# EAGLE design Blueshift V1 (EAGLE 9.5.1)
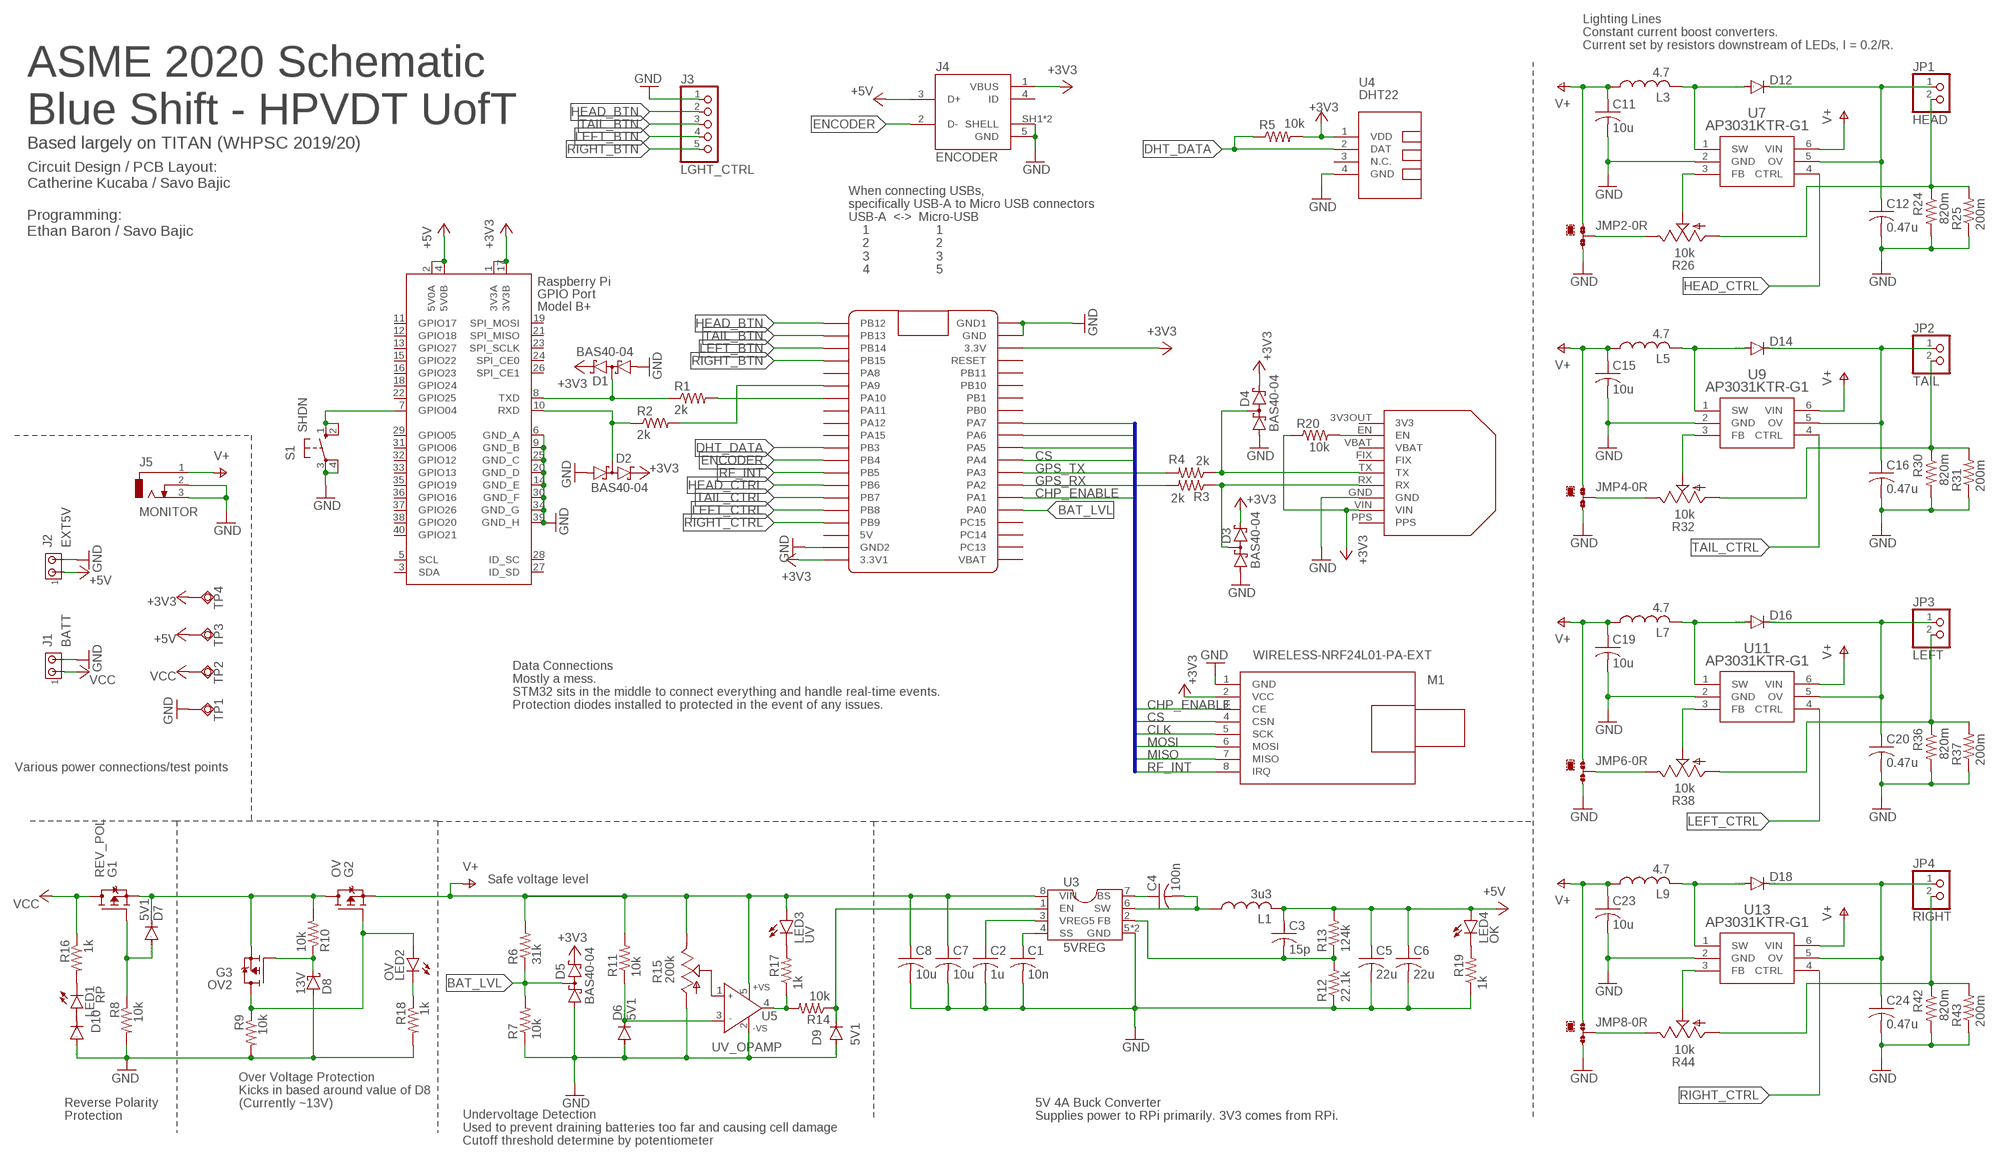
[diagram p0: schematic, sheet 1]

## Parts
C1  10n  C-USC0402  [C0402]
C2  1u  C-USC0402  [C0402]
C3  15p  C-USC0402  [C0402]
C4  100n  C-USC0402  [C0402]
C5  22u  C-USC0805  [C0805]
C6  22u  C-USC0805  [C0805]
C7  10u  C-USC0805  [C0805]
C8  10u  C-USC0805  [C0805]
C11  10u  C-USC1206K  [C1206K]
C12  0.47u  C-USC1206K  [C1206K]
C15  10u  C-USC1206K  [C1206K]
C16  0.47u  C-USC1206K  [C1206K]
C19  10u  C-USC1206K  [C1206K]
C20  0.47u  C-USC1206K  [C1206K]
C23  10u  C-USC1206K  [C1206K]
C24  0.47u  C-USC1206K  [C1206K]
D1  BAS40-04  [SOT23]
D2  BAS40-04  [SOT23]
D3  BAS40-04  [SOT23]
D4  BAS40-04  [SOT23]
D5  BAS40-04  [SOT23]
D6  5V1  DIODE-SOD323-R  [SOD323-R]
D7  5V1  DIODE-SOD323-R  [SOD323-R]
D8  13V  BAS70  [SOT23]
D9  5V1  DIODE-SOD323-R  [SOD323-R]
D10  DIODE-SOD80C  [SOD80C]
D12  DIODE-DO-214AC  [DO-214AC]
D14  DIODE-DO-214AC  [DO-214AC]
D16  DIODE-DO-214AC  [DO-214AC]
D18  DIODE-DO-214AC  [DO-214AC]
G1  REV_POL  SI3493DDV-T1-GE3  [TSOP-6]
G2  OV  SI3493DDV-T1-GE3  [TSOP-6]
G3  OV2  SI3493DDV-T1-GE3  [TSOP-6]
J1  BATT  MTA02-156  [1X2MTA]
J2  EXT5V  MTA02-156  [1X2MTA]
J3  LGHT_CTRL  PINHD-1X5  [1X05]
J4  ENCODER  2172034-1  [TE_2172034-1]
J5  MONITOR  DCJ0303  [DCJ0303]
JMP2  0R-JUMPA  [A0R-JMP]
JMP4  0R-JUMPA  [A0R-JMP]
JMP6  0R-JUMPA  [A0R-JMP]
JMP8  0R-JUMPA  [A0R-JMP]
JP1  HEAD  PINHD-1X2  [1X02]
JP2  TAIL  PINHD-1X2  [1X02]
JP3  LEFT  PINHD-1X2  [1X02]
JP4  RIGHT  PINHD-1X2  [1X02]
L1  3u3  SDES064T-3R3MS  [SDES064T]
L3  4.7  NR6028NR6028  [INDDFN600X600X280-2N]
L5  4.7  NR6028NR6028  [INDDFN600X600X280-2N]
L7  4.7  NR6028NR6028  [INDDFN600X600X280-2N]
L9  4.7  NR6028NR6028  [INDDFN600X600X280-2N]
LED1  RP  LEDSML0805  [SML0805]
LED2  OV  LEDSML0805  [SML0805]
LED3  UV  LEDSML0805  [SML0805]
LED4  OK  LEDSML0805  [SML0805]
M1  WIRELESS-NRF24L01-PA-EXT  [WIRELESS-NRF24L01-PA-EXT]
M2  ULTIMATE-GPS  [ULTIMATE_GPS]
R1  2k  R-US_R0402  [R0402]
R2  2k  R-US_R0402  [R0402]
R3  2k  R-US_R0402  [R0402]
R4  2k  R-US_R0402  [R0402]
R5  10k  R-US_R0402  [R0402]
R6  31k  R-US_R0402  [R0402]
R7  10k  R-US_R0402  [R0402]
R8  10k  R-US_R0402  [R0402]
R9  10k  R-US_R0402  [R0402]
R10  10k  R-US_R0402  [R0402]
R11  10k  R-US_R0402  [R0402]
R12  22.1k  R-US_R0402  [R0402]
R13  124k  R-US_R0402  [R0402]
R14  10k  R-US_R0402  [R0402]
R15  200k  TRIM_US-CA6V  [CA6V]
R16  1k  R-US_R0402  [R0402]
R17  1k  R-US_R0402  [R0402]
R18  1k  R-US_R0402  [R0402]
R19  1k  R-US_R0402  [R0402]
R20  10k  R-US_R0402  [R0402]
R24  820m  R-US_R0603  [R0603]
R25  200m  R-US_R0805  [R0805]
R26  10k  TRIM_US-RJ9W  [RJ9W]
R30  820m  R-US_R0603  [R0603]
R31  200m  R-US_R0805  [R0805]
R32  10k  TRIM_US-RJ9W  [RJ9W]
R36  820m  R-US_R0603  [R0603]
R37  200m  R-US_R0805  [R0805]
R38  10k  TRIM_US-RJ9W  [RJ9W]
R42  820m  R-US_R0603  [R0603]
R43  200m  R-US_R0805  [R0805]
R44  10k  TRIM_US-RJ9W  [RJ9W]
S1  SHDN  10-XX  [B3F-10XX]
TP1  TPSQTP20SQ  [TP20SQ]
TP2  TPSQTP20R  [TP20R]
TP3  TPSQTP20R  [TP20R]
TP4  TPSQTP20R  [TP20R]
U1  RASPI_HAT  [RASPI_BOARD_B+HAT_CF]
U2  BLUEPILL  BLUE_PILL  [BLUE_PILL]
U3  5VREG  AP65450SP-13  [SO-8EP]
U4  DHT22  TEMP-HUM-SENSOR-DHT22  [TEMP-HUM-SENSOR-DHT22]
U5  UV_OPAMP  TA75S558F,LF  [SOT-753]
U7  AP3031KTR-G1  [SOT23-6]
U9  AP3031KTR-G1  [SOT23-6]
U11  AP3031KTR-G1  [SOT23-6]
U13  AP3031KTR-G1  [SOT23-6]

## Nets
5V_FB: C3.2 R12.2 R13.1 U3.2(FB)
+3V3: D1.2(C2) D2.2(C2) D3.2(C2) D4.2(C2) D5.2(C2) J4.1(VBUS) M1.2(VCC) M2.VIN R5.2 R20.1 TP4.TP U1.1(3V3A) U1.17(3V3B) U2.P$20(3.3V1) U2.P$23(3.3V) U4.1(VDD)
+5V: C3.1 C5.1 C6.1 J2.1 J4.3(D+) L1.2 LED4.A R13.2 TP3.TP U1.2(5V0A) U1.4(5V0B)
BAT_LVL: D5.3(C1A2) R6.1 R7.2 U2.P$36(PA0)
CHP_ENABLE: M1.3(CE) U2.P$35(PA1)
CLK: M1.5(SCK) U2.P$31(PA5)
CS: M1.4(CSN) U2.P$32(PA4)
DHT_DATA: R5.1 U2.P$11(PB3) U4.2(DAT)
ENCODER: J4.2(D-) U2.P$12(PB4)
GND: C1.2 C2.2 C5.2 C6.2 C7.2 C8.2 C11.2 C12.2 C15.2 C16.2 C19.2 C20.2 C23.2 C24.2 D1.1(A1) D2.1(A1) D3.1(A1) D4.1(A1) D5.1(A1) D6.A D8.1(A) D9.A D10.A J1.2 J2.2 J3.1 J4.5(GND) J4.SH1(SHELL) J4.SH2(SHELL) J5.2 J5.3 JMP2.3 JMP4.3 JMP6.3 JMP8.3 M1.1(GND) M2.GND R7.1 R8.2 R9.2 R12.1 R15.A R18.2 R19.1 R24.2 R25.1 R30.2 R31.1 R36.2 R37.1 R42.2 R43.1 S1.3(P) S1.4(P1) TP1.TP U1.6(GND_A) U1.9(GND_B) U1.14(GND_E) U1.20(GND_D) U1.25(GND_C) U1.30(GND_F) U1.34(GND_G) U1.39(GND_H) U2.P$19(GND2) U2.P$21(GND1) U2.P$22(GND) U3.5(GND) U3.TP(GND) U4.4(GND) U5.2(-VS) U7.2(GND) U9.2(GND) U11.2(GND) U13.2(GND)
GPS_RX: R3.2 U2.P$34(PA2)
GPS_TX: R4.2 U2.P$33(PA3)
HEAD_BTN: J3.2 U2.P$1(PB12)
HEAD_CTRL: U2.P$14(PB6) U7.4(CTRL)
LEFT_BTN: J3.4 U2.P$3(PB14)
LEFT_CTRL: U2.P$16(PB8) U11.4(CTRL)
MISO: M1.7(MISO) U2.P$30(PA6)
MOSI: M1.6(MOSI) U2.P$29(PA7)
N$1: R1.2 U2.P$7(PA10)
N$2: R2.2 U2.P$6(PA9)
N$3: D1.3(C1A2) R1.1 U1.8(TXD)
N$4: D2.3(C1A2) R2.1 U1.10(RXD)
N$5: D3.3(C1A2) M2.RX R3.1
N$6: S1.1(S) S1.2(S1) U1.7(GPIO04)
N$7: D8.3(C) G3.3(G) R10.1
N$8: D7.A G1.3(G) R8.1
N$9: D4.3(C1A2) M2.TX R4.1
N$10: G2.3(G) G3.1(D) G3.2(D) G3.5(D) G3.6(D) LED2.A R9.1
N$11: LED3.C R17.2
N$12: C1.1 U3.4(SS)
N$13: D6.C R11.1 U5.3(IN-)
N$14: C4.2 L1.1 U3.6(SW)
N$15: C2.1 U3.3(VREG5)
N$16: C4.1 U3.7(BS)
N$17: R14.2 R17.1 U5.4(OUT)
N$18: D9.C R14.1 U3.1(EN)
N$19: R15.S U5.1(IN+)
N$20: LED1.C R16.2
N$21: D10.C LED1.A
N$22: M2.EN R20.2
N$23: LED2.C R18.1
N$24: LED4.C R19.2
N$25: D7.C G1.4(S) G2.1(D) G2.2(D) G2.5(D) G2.6(D) G3.4(S) R10.2
N$31: D12.A L3.2 U7.1(SW)
N$32: JMP2.2 R26.E
N$33: R26.S U7.3(FB)
N$34: C12.1 D12.C JP1.1 U7.5(OV)
N$35: JP1.2 R24.1 R25.2 R26.A
N$41: D14.A L5.2 U9.1(SW)
N$42: JMP4.2 R32.E
N$43: R32.S U9.3(FB)
N$44: C16.1 D14.C JP2.1 U9.5(OV)
N$45: JP2.2 R30.1 R31.2 R32.A
N$51: D16.A L7.2 U11.1(SW)
N$52: JMP6.2 R38.E
N$53: R38.S U11.3(FB)
N$54: C20.1 D16.C JP3.1 U11.5(OV)
N$55: JP3.2 R36.1 R37.2 R38.A
N$61: D18.A L9.2 U13.1(SW)
N$62: JMP8.2 R44.E
N$63: R44.S U13.3(FB)
N$64: C24.1 D18.C JP4.1 U13.5(OV)
N$65: JP4.2 R42.1 R43.2 R44.A
RF_INT: M1.8(IRQ) U2.P$13(PB5)
RIGHT_BTN: J3.5 U2.P$4(PB15)
RIGHT_CTRL: U2.P$17(PB9) U13.4(CTRL)
TAIL_BTN: J3.3 U2.P$2(PB13)
TAIL_CTRL: U2.P$15(PB7) U9.4(CTRL)
V+: C7.1 C8.1 C11.1 C15.1 C19.1 C23.1 G2.4(S) J5.1 JMP2.1 JMP4.1 JMP6.1 JMP8.1 L3.1 L5.1 L7.1 L9.1 LED3.A R6.2 R11.2 R15.E U3.8(VIN) U5.5(+VS) U7.6(VIN) U9.6(VIN) U11.6(VIN) U13.6(VIN)
VCC: G1.1(D) G1.2(D) G1.5(D) G1.6(D) J1.1 R16.1 TP2.TP
Unconnected: J4.4(ID) M2.3V3OUT(3V3) M2.FIX M2.PPS M2.VBAT U1.3(SDA) U1.5(SCL) U1.11(GPIO17) U1.12(GPIO18) U1.13(GPIO27) U1.15(GPIO22) U1.16(GPIO23) U1.18(GPIO24) U1.19(SPI_MOSI) U1.21(SPI_MISO) U1.22(GPIO25) U1.23(SPI_SCLK) U1.24(SPI_CE0) U1.26(SPI_CE1) U1.27(ID_SD) U1.28(ID_SC) U1.29(GPIO05) U1.31(GPIO06) U1.32(GPIO12) U1.33(GPIO13) U1.35(GPIO19) U1.36(GPIO16) U1.37(GPIO26) U1.38(GPIO20) U1.40(GPIO21) U2.P$5(PA8) U2.P$8(PA11) U2.P$9(PA12) U2.P$10(PA15) U2.P$18(5V) U2.P$24(RESET) U2.P$25(PB11) U2.P$26(PB10) U2.P$27(PB1) U2.P$28(PB0) U2.P$37(PC15) U2.P$38(PC14) U2.P$39(PC13) U2.P$40(VBAT) U4.3(N.C.)

## Buses
SPI:CHP_ENABLE,CLK,CS,MISO,MOSI,RF_INT

## Notes on the sheet
- Lighting Lines
  Constant current boost converters. 
  Current set by resistors downstream of LEDs, I = 0.2/R.
- ASME 2020 Schematic
  Blue Shift - HPVDT UofT
- Based largely on TITAN (WHPSC 2019/20)
- Circuit Design / PCB Layout:
  Catherine Kucaba / Savo Bajic
  
  Programming:
  Ethan Baron / Savo Bajic
- When connecting USBs, 
  specifically USB-A to Micro USB connectors
  USB-A  <->  Micro-USB
      1                   1
      2                   2
      3                   3
      4                   5
- Data Connections
  Mostly a mess.
  STM32 sits in the middle to connect everything and handle real-time events.
  Protection diodes installed to protected in the event of any issues.
- Various power connections/test points
- Safe voltage level
- Over Voltage Protection
  Kicks in based around value of D8
  (Currently ~13V)
- Reverse Polarity
  Protection
- 5V 4A Buck Converter
  Supplies power to RPi primarily. 3V3 comes from RPi.
- Undervoltage Detection
  Used to prevent draining batteries too far and causing cell damage
  Cutoff threshold determine by potentiometer

## Library data of the parts
C1-C8 C11 C12 C15 C16 C19 C20 C23 C24 = rcl:C-US: CAPACITOR, American symbol; SPICEPREFIX: C
D1-D5 = diode:BAS40-04: Silicon Schottky Diodes General-purpose diode for high-speed switching
D6 D7 D9 D10 D12 D14 D16 D18 = diode:DIODE-: DIODE
D8 = diode:BAS70: Silicon Schottky Diodes General-purpose diode for high-speed switching
G1-G3 = ASME2020_parts:SI3493DDV-T1-GE3: 20V P-CH MOSFET
J1 J2 = con-amp:MTA02-156: AMP connector
J3 = pinhead:PINHD-1X5: PIN HEADER
J4 = 2172034-1:2172034-1: CONN RCPT USB MINI B 2.0 PCB R/A; COMMENT: 2172034-1; DESCRIPTION: Conn Mini USB Type B RCP 5 POS 0.8mm Solder RA Thru-Hole 5 Terminal 1 Port Box/Tray; DIGI-KEY_PART_NUMBER: A135698-ND; DIGI-KEY_PURCHASE_URL: https://www.digikey.com/product-detail/en/te-connectivity-amp-connectors/2172034-1/A135698-ND/5592056?utm_source=snapeda&utm_medium=aggregator&utm_campaign=symbol; EU_ROHS_COMPLIANCE: Compliant; MF: TE Connectivity; MP: 2172034-1; PACKAGE: None; TE_PURCHASE_URL: https://www.te.com/usa-en/product-2172034-1.html?te_bu=Cor&te_type=disp&te_campaign=seda_glo_cor-seda-global-disp-prtnr-fy19-seda-model-bom-cta_sma-317_1&elqCampaignId=32493
J5 = con-jack:DCJ0303: DC POWER JACK Source: DCJ0303.pdf; OC_FARNELL: unknown; OC_NEWARK: unknown
JMP2 JMP4 JMP6 JMP8 = jump-0r-smd:0R-JUMP: SMD 0R 0805 Jumper
JP1-JP4 = pinhead:PINHD-1X2: PIN HEADER
L1 = ASME2020_parts:SDES064T-3R3MS
L3 L5 L7 L9 = Lighting IC:NR6028
LED1-LED4 = led:LED: LED OSRAM: - CHIPLED LG R971, LG N971, LY N971, LG Q971, LY Q971, LO R971, LY R971 LH N974, LH R974 LS Q976, LO Q976, LY Q976 LO Q996 - Hyper CHIPLED LW Q18S LB Q993, LB Q99A, LB R99A - SideLED LS A670, LO A670, LY A670, LG A670, LP A670 LB A673, LV A673, LT A673, LW A673 LH A674 LY A675 LS A676, LA A676, LO A676, LY A676, LW A676 LS A679, LY A679, LG A679 - Hyper Micro SIDELED® LS Y876, LA Y876, LO Y876, LY Y876 LT Y87S - SmartLED LW L88C, LW L88S LB L89C, LB L89S, LG L890 LS L89K, LO L89K, LY L89K LS L896, LA L896, LO L896, LY L896 - TOPLED LS T670, LO T670, LY T670, LG T670, LP T670 LSG T670, LSP T670, LSY T670, LOP T670, LYG T670 LG T671, LOG T671, LSG T671 LB T673, LV T673, LT T673, LW T673 LH T674 LS T676, LA T676, LO T676, LY T676, LB T676, LH T676, LSB T676, LW T676 LB T67C, LV T67C, LT T67C, LS T67K, LO T67K, LY T67K, LW E67C LS E67B, LA E67B, LO E67B, LY E67B, LB E67C, LV E67C, LT E67C LW T67C LS T679, LY T679, LG T679 LS T770, LO T770, LY T770, LG T770, LP T770 LB T773, LV T773, LT T773, LW T773 LH T774 LS E675, LA E675, LY E675, LS T675 LS T776, LA T776, LO T776, LY T776, LB T776 LHGB T686 LT T68C, LB T68C - Hyper Mini TOPLED® LB M676 - Mini TOPLED Santana® LG M470 LS M47K, LO M47K, LY M47K Source: http://www.osram.convergy.de LUXEON: - LUMILED® LXK2-PW12-R00, LXK2-PW12-S00, LXK2-PW14-U00, LXK2-PW14-V00 LXK2-PM12-R00, LXK2-PM12-S00, LXK2-PM14-U00 LXK2-PE12-Q00, LXK2-PE12-R00, LXK2-PE12-S00, LXK2-PE14-T00, LXK2-PE14-U00 LXK2-PB12-K00, LXK2-PB12-L00, LXK2-PB12-M00, LXK2-PB14-N00, LXK2-PB14-P00, LXK2-PB14-Q00 LXK2-PR12-L00, LXK2-PR12-M00, LXK2-PR14-Q00, LXK2-PR14-R00 LXK2-PD12-Q00, LXK2-PD12-R00, LXK2-PD12-S00 LXK2-PH12-R00, LXK2-PH12-S00 LXK2-PL12-P00, LXK2-PL12-Q00, LXK2-PL12-R00 Source: www.luxeon.com KINGBRIGHT: KA-3528ASYC Source: www.kingbright.com
M1 = diy-modules:WIRELESS-NRF24L01-PA-EXT: 2.4 GHz Wireless Module based on NRF24L01 chip with preamplifier and external antenna Click here to find device on ebay.com <http://www.ebay.com/sch/nrf24l01+pa+lna+sma>
M2 = diy-modules:ULTIMATE-GPS
R1-R14 R16-R20 R24 R25 R30 R31 R36 R37 R42 R43 = rcl:R-US_: RESISTOR, American symbol; SPICEPREFIX: R
R15 R26 R32 R38 R44 = pot:TRIM_US-: POTENTIOMETER
S1 = switch-omron:10-XX: OMRON SWITCH; MPN: B3F-1000; OC_FARNELL: 176432; OC_NEWARK: 36M3542
TP1-TP4 = testpad:TPSQ: Test pad
U1 = raspberrypi_bastelstube_v13:RASPI_HAT
U2 = BluePill:BLUE_PILL
U3 = ASME2020_parts:AP65450SP-13: AP65450 4A, 18V, 650kHz ADAPTIVE COT STEP-DOWN CONVERTER
U4 = diy-modules:TEMP-HUM-SENSOR-DHT22: DHT22 - digital humidity & temperature sensor Also known as: AM2302 AM2302 datasheet available here: http://akizukidenshi.com/download/ds/aosong/AM2302.pdf Click here to find device on ebay.com <http://www.ebay.com/sch/dht22+digital+sensor>
U5 = ASME2020_parts:TA75S558F,LF
U7 U9 U11 U13 = Lighting IC:AP3031KTR-G1: AP3031 step-up LED driver chip for LEDs up to 1.4A; MANUFACTURER_PART_NUMBER: AP3031KTRG1; VENDOR: Diodes Inc

## Board
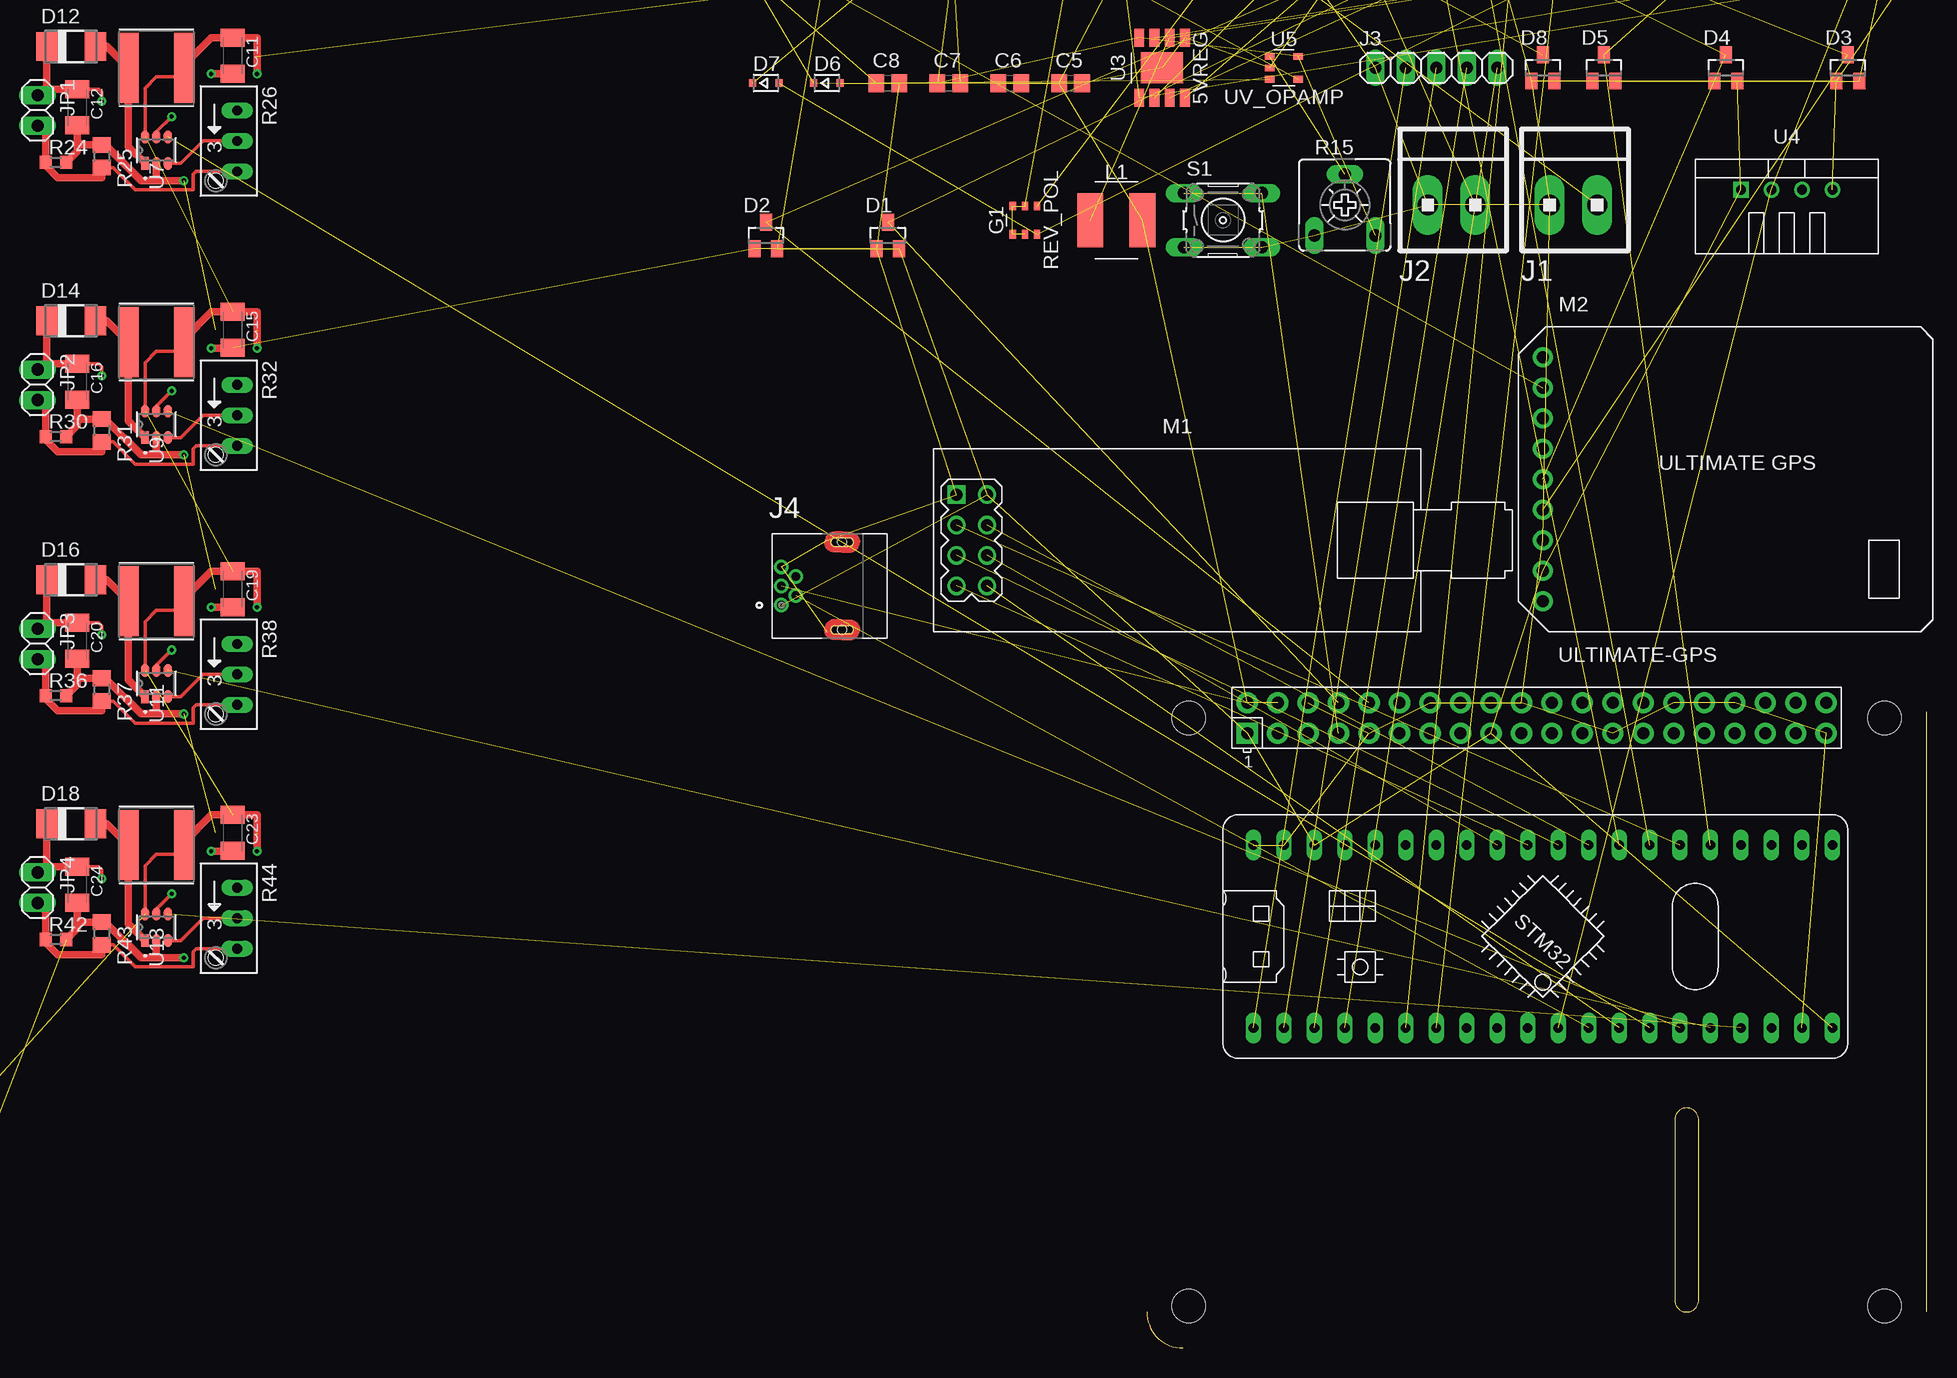
[diagram p1: board, top side]
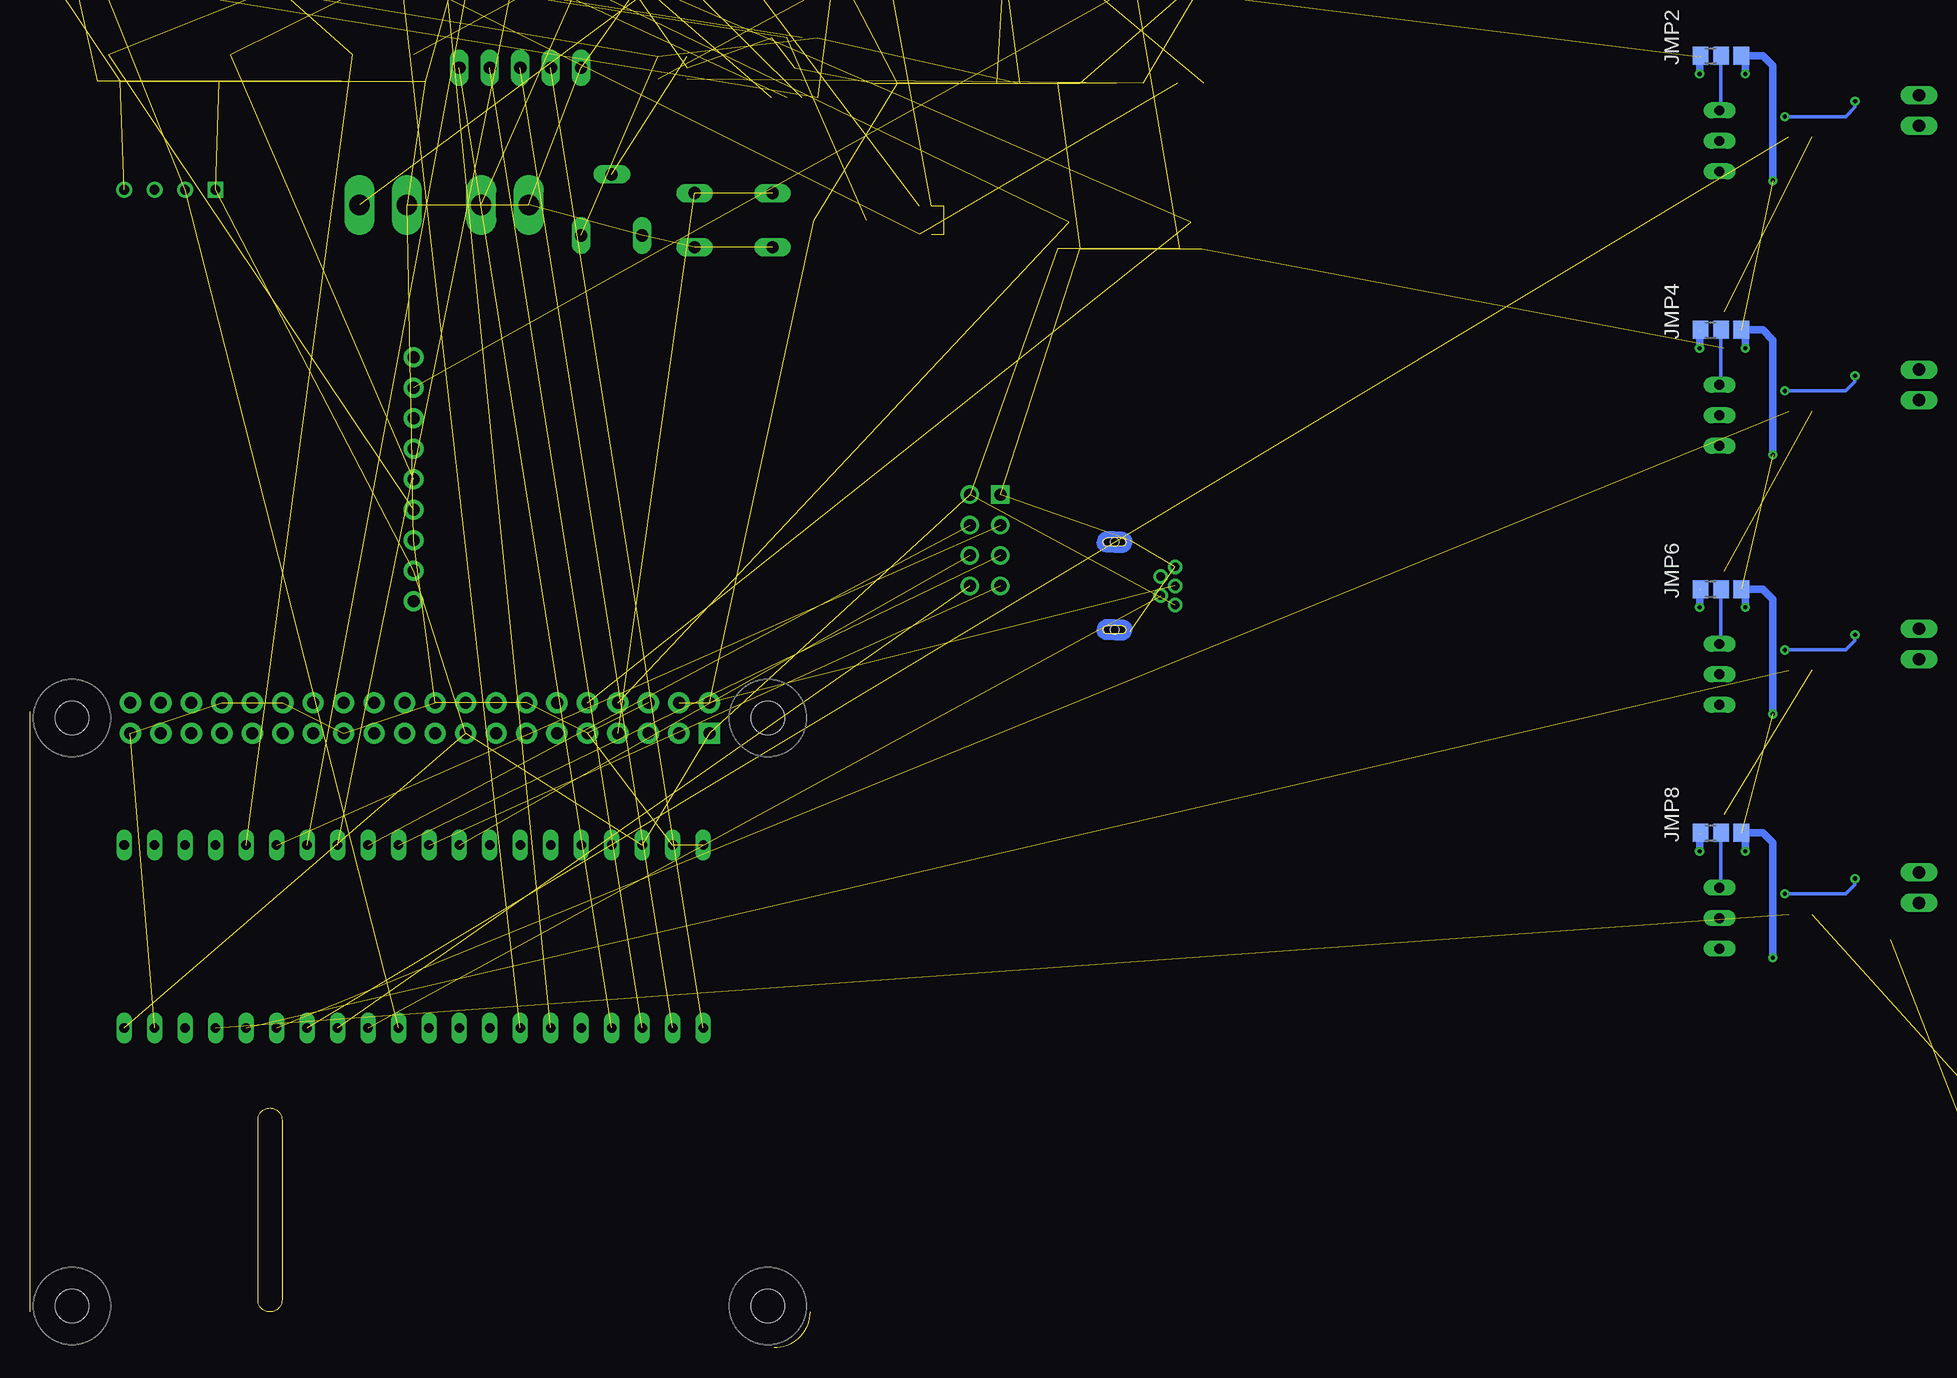
[diagram p2: board, bottom side, seen from below]

Size 65 x 53 mm. Coordinates in mm from the lower left corner, seen from the top.
Copper layers (1*16): Top 0.035mm / dielectric 1.5mm / Bottom 0.035mm
Design rules "default": minimum track width 6mil, minimum drill 0.35mm, track to track 6mil, track to pad 6mil, pad to pad 6mil, via to via 6mil, smd to smd 6mil, copper to edge 40mil, drill to drill 6mil, minimum pad ring 10mil, minimum via ring 8mil, stop-mask expansion 4mil, vias tented up to drill 0mil, thermal gap 10mil

### Footprints (pad centres in the part's own frame; a part is rotated, then mirrored left to right if it is on the bottom)
C0402 = smd 0.7 x 0.9: 1 -0.65,0; 2 0.65,0
C0805 = smd 1.3 x 1.5: 1 -0.95,0; 2 0.95,0
C1206K = smd 1.5 x 2: 1 -1.5,0; 2 1.5,0
SOT23 = smd 1 x 1.4: 1 -0.95,-1.1; 2 0.95,-1.1; 3 0,1.1
SOD323-R = smd 0.6 x 0.6: A 1.1,0; C -1.1,0
SOD80C = smd 1.4 x 1.8: A 1.7,0; C -1.7,0
DO-214AC = smd 1.8 x 2.4: A 2.025,0; C -2.025,0
TSOP-6 = smd 0.508 x 0.711: 1 -1.016,-1.168; 2 0,-1.168; 3 1.016,-1.168; 4 1.016,1.168; 5 0,1.168; 6 -1.016,1.168
1X2MTA = drill 1.676 long: 1 1.981,0; 2 -1.981,0
1X05 = drill 1.016 long: 1 -5.08,0; 2 -2.54,0; 3 0,0; 4 2.54,0; 5 5.08,0
TE_2172034-1 = drill 0.7: 1 -5.05,-1.6; 2 -3.85,-0.8; 3 -5.05,0; 4 -3.85,0.8; 5 -5.05,1.6 | smd 0.1 x 0.1: SH1 -1.27,3.81; SH2 -1.27,-3.81 | hole 0.7: 0,3.65; 0,-3.65
DCJ0303 = drill 1 pad 2 long: 1 0,3.1; 2 4.8,0; 3 0,-3
A0R-JMP = smd 1.5 x 1.3: 1 0,1.7; 2 0,0; 3 0,-1.7
1X02 = drill 1.016 long: 1 -1.27,0; 2 1.27,0
SDES064T = smd 2.15 x 4.5: 1 -2.175,0; 2 2.175,0
INDDFN600X600X280-2N = smd 1.712 x 5.812: 1 -2.35,0; 2 2.35,0
SML0805 = smd 1.2 x 1.2: A 1.05,0; C -1.05,0
WIRELESS-NRF24L01-PA-EXT = drill 1 square: 1 -18.415,3.81 | drill 1: 2 -15.875,3.81; 3 -18.415,1.27; 4 -15.875,1.27; 5 -18.415,-1.27; 6 -15.875,-1.27; 7 -18.415,-3.81; 8 -15.875,-3.81
ULTIMATE_GPS = drill 1 pad 1.676: 3V3OUT 0,10.16; EN 0,7.62; FIX 0,2.54; GND 0,-5.08; PPS 0,-10.16; RX 0,-2.54; TX 0,0; VBAT 0,5.08; VIN 0,-7.62
R0402 = smd 0.6 x 0.7: 1 -0.5,0; 2 0.5,0
CA6V = drill 1.016 long: A -2.54,-2.54; E 2.54,-2.54; S 0,2.54
R0603 = smd 1 x 1.1: 1 -0.85,0; 2 0.85,0
R0805 = smd 1.3 x 1.5: 1 -0.95,0; 2 0.95,0
RJ9W = drill 0.813 long: A 2.54,0.635; E -2.54,0.635; S 0,0.635
B3F-10XX = drill 1.016 long: 1 -3.251,2.261; 2 3.251,2.261; 3 -3.251,-2.261; 4 3.251,-2.261
TP20SQ = smd 2 x 2: TP 0,0
TP20R = smd 2 x 2: TP 0,0
RASPI_BOARD_B+HAT_CF = drill 1 pad 1.778 square: 1 8.37,51.23 | drill 1 pad 1.778: 2 8.37,53.77; 3 10.91,51.23; 4 10.91,53.77; 5 13.45,51.23; 6 13.45,53.77; 7 15.99,51.23; 8 15.99,53.77; 9 18.53,51.23; 10 18.53,53.77; 11 21.07,51.23; 12 21.07,53.77; 13 23.61,51.23; 14 23.61,53.77; 15 26.15,51.23; 16 26.15,53.77; 17 28.69,51.23; 18 28.69,53.77; 19 31.23,51.23; 20 31.23,53.77; 21 33.77,51.23; 22 33.77,53.77; 23 36.31,51.23; 24 36.31,53.77; 25 38.85,51.23; 26 38.85,53.77; 27 41.39,51.23; 28 41.39,53.77; 29 43.93,51.23; 30 43.93,53.77; 31 46.47,51.23; 32 46.47,53.77; 33 49.01,51.23; 34 49.01,53.77; 35 51.55,51.23; 36 51.55,53.77; 37 54.09,51.23; 38 54.09,53.77; 39 56.63,51.23; 40 56.63,53.77 | hole 2.75: 3.5,3.5; 3.5,52.5; 61.5,3.5; 61.5,52.5
BLUE_PILL = drill 0.8 long: P$1 -7.62,15.24; P$2 -7.62,12.7; P$3 -7.62,10.16; P$4 -7.62,7.62; P$5 -7.62,5.08; P$6 -7.62,2.54; P$7 -7.62,0; P$8 -7.62,-2.54; P$9 -7.62,-5.08; P$10 -7.62,-7.62; P$11 -7.62,-10.16; P$12 -7.62,-12.7; P$13 -7.62,-15.24; P$14 -7.62,-17.78; P$15 -7.62,-20.32; P$16 -7.62,-22.86; P$17 -7.62,-25.4; P$18 -7.62,-27.94; P$19 -7.62,-30.48; P$20 -7.62,-33.02; P$21 7.62,15.24; P$22 7.62,12.7; P$23 7.62,10.16; P$24 7.62,7.62; P$25 7.62,5.08; P$26 7.62,2.54; P$27 7.62,0; P$28 7.62,-2.54; P$29 7.62,-5.08; P$30 7.62,-7.62; P$31 7.62,-10.16; P$32 7.62,-12.7; P$33 7.62,-15.24; P$34 7.62,-17.78; P$35 7.62,-20.32; P$36 7.62,-22.86; P$37 7.62,-25.4; P$38 7.62,-27.94; P$39 7.62,-30.48; P$40 7.62,-33.02
SO-8EP = smd 0.802 x 1.505: 1 -1.905,-2.498; 2 -0.635,-2.498; 3 0.635,-2.498; 4 1.905,-2.498; 5 1.905,2.498; 6 0.635,2.498; 7 -0.635,2.498; 8 -1.905,2.498 | smd 3.502 x 2.613: TP 0,0
TEMP-HUM-SENSOR-DHT22 = drill 0.8 square: 1 -3.81,0 | drill 0.8: 2 -1.27,0; 3 1.27,0; 4 3.81,0
SOT-753 = smd 0.8 x 0.55: 1 -1.2,0.95; 2 -1.2,0; 3 -1.2,-0.95; 4 1.2,-0.95; 5 1.2,0.95
SOT23-6 = smd 1.06 x 0.65: 1 -1.1,0.95; 2 -1.1,0; 3 -1.1,-0.95; 4 1.1,-0.95; 5 1.1,0; 6 1.1,0.95

### Placement (x,y rotation side)
C1  13.97,113.03 0 top  (outside the outline)
C2  38.1,120.65 0 top  (outside the outline)
C3  8.89,113.03 0 top  (outside the outline)
C4  25.4,113.03 0 top  (outside the outline)
C5  -6.35,105.41 0 top  (outside the outline)
C6  -11.43,105.41 0 top  (outside the outline)
C7  -16.51,105.41 0 top  (outside the outline)
C8  -21.59,105.41 0 top  (outside the outline)
C11  -76.2,107.7 270 top  (outside the outline)
C12  -89.15,103.38 270 top  (outside the outline)
C15  -76.2,84.84 270 top  (outside the outline)
C16  -89.15,80.52 270 top  (outside the outline)
C19  -76.2,63.25 270 top  (outside the outline)
C20  -89.15,58.93 270 top  (outside the outline)
C23  -76.2,42.93 270 top  (outside the outline)
C24  -89.15,38.61 270 top  (outside the outline)
D1  -21.59,92.71 0 top  (outside the outline)
D2  -31.75,92.71 0 top  (outside the outline)
D3  58.42,106.68 0 top  (outside the outline)
D4  48.26,106.68 0 top  (outside the outline)
D5  38.1,106.68 0 top  (outside the outline)
D6  -26.67,105.41 0 top  (outside the outline)
D7  -31.75,105.41 0 top  (outside the outline)
D8  33.02,106.68 0 top  (outside the outline)
D9  62.23,114.3 0 top  (outside the outline)
D10  -10.16,119.38 0 top  (outside the outline)
D12  -89.66,108.46 0 top  (outside the outline)
D14  -89.66,85.6 0 top  (outside the outline)
D16  -89.66,64.01 0 top  (outside the outline)
D18  -89.66,43.69 0 top  (outside the outline)
G1  -10.16,93.98 0 top  (outside the outline)
G2  -16.51,119.38 0 top  (outside the outline)
G3  12.7,119.38 0 top  (outside the outline)
J1  35.56,95.25 0 top  (outside the outline)
J2  25.4,95.25 0 top  (outside the outline)
J3  24.13,106.68 0 top  (outside the outline)
J4  -25.4,63.5 0 top  (outside the outline)
J5  -104.14,10.16 0 top  (outside the outline)
JMP2  -75.95,107.7 90 bottom  (outside the outline)
JMP4  -75.95,84.84 90 bottom  (outside the outline)
JMP6  -75.95,63.25 90 bottom  (outside the outline)
JMP8  -75.95,42.93 90 bottom  (outside the outline)
JP1  -92.46,103.12 270 top  (outside the outline)
JP2  -92.46,80.26 270 top  (outside the outline)
JP3  -92.46,58.67 270 top  (outside the outline)
JP4  -92.46,38.35 270 top  (outside the outline)
L1  -2.54,93.98 0 top  (outside the outline)
L3  -82.55,106.68 180 top  (outside the outline)
L5  -82.55,83.82 180 top  (outside the outline)
L7  -82.55,62.23 180 top  (outside the outline)
L9  -82.55,41.91 180 top  (outside the outline)
LED1  55.88,113.03 0 top  (outside the outline)
LED2  49.53,113.03 0 top  (outside the outline)
LED3  43.18,113.03 0 top  (outside the outline)
LED4  36.83,113.03 0 top  (outside the outline)
M1  2.54,67.31 0 top  (outside the outline)
M2  33.02,72.39 0 top  (outside the outline)
R1  34.29,120.65 0 top  (outside the outline)
R2  30.48,120.65 0 top  (outside the outline)
R3  26.67,120.65 0 top  (outside the outline)
R4  22.86,120.65 0 top  (outside the outline)
R5  62.23,120.65 0 top  (outside the outline)
R6  57.15,120.65 0 top  (outside the outline)
R7  52.07,120.65 0 top  (outside the outline)
R8  46.99,120.65 0 top  (outside the outline)
R9  41.91,120.65 0 top  (outside the outline)
R10  3.81,113.03 0 top  (outside the outline)
R11  -31.75,113.03 0 top  (outside the outline)
R12  30.48,113.03 0 top  (outside the outline)
R13  19.05,113.03 0 top  (outside the outline)
R14  -1.27,113.03 0 top  (outside the outline)
R15  16.51,95.25 0 top  (outside the outline)
R16  -6.35,113.03 0 top  (outside the outline)
R17  -11.43,113.03 0 top  (outside the outline)
R18  -16.51,113.03 0 top  (outside the outline)
R19  -21.59,113.03 0 top  (outside the outline)
R20  -26.67,113.03 0 top  (outside the outline)
R24  -90.93,98.81 0 top  (outside the outline)
R25  -87.12,99.31 270 top  (outside the outline)
R26  -76.45,100.58 270 top  (outside the outline)
R30  -90.93,75.95 0 top  (outside the outline)
R31  -87.12,76.45 270 top  (outside the outline)
R32  -76.45,77.72 270 top  (outside the outline)
R36  -90.93,54.36 0 top  (outside the outline)
R37  -87.12,54.86 270 top  (outside the outline)
R38  -76.45,56.13 270 top  (outside the outline)
R42  -90.93,34.04 0 top  (outside the outline)
R43  -87.12,34.54 270 top  (outside the outline)
R44  -76.45,35.81 270 top  (outside the outline)
S1  6.35,93.98 0 top  (outside the outline)
TP1  17.78,119.38 0 top  (outside the outline)
TP2  5.08,119.38 0 top  (outside the outline)
TP3  0,119.38 0 top  (outside the outline)
TP4  -5.08,119.38 0 top  (outside the outline)
U1  0,0 0 top
U2  24.13,34.29 90 top
U3  1.27,106.68 0 top  (outside the outline)
U4  53.34,96.52 0 top  (outside the outline)
U5  11.43,106.68 0 top  (outside the outline)
U7  -82.55,99.82 90 top  (outside the outline)
U9  -82.55,76.96 90 top  (outside the outline)
U11  -82.55,55.37 90 top  (outside the outline)
U13  -82.55,35.05 90 top  (outside the outline)

### Tracks (layer width: path | path; a pad name or v marks a point on that pad's centre or on a via)
5V_FB  (3 unrouted)
+3V3  (15 unrouted)
+5V  (10 unrouted)
BAT_LVL  (3 unrouted)
CHP_ENABLE  (1 unrouted)
CLK  (1 unrouted)
CS  (1 unrouted)
DHT_DATA  (2 unrouted)
ENCODER  (1 unrouted)
GND  (via drill 0.35)  (53 unrouted)
  Top 0.635: -82.55,97.28 -83.82,97.28 -86.8,100.26 R25.1 -88.83,100.26 -89.15,100.58 | -82.55,97.28 U7.2 | v-80.26,97.28 -82.55,97.28 | v-77.98,106.17 -76.22,106.17 C11.2 | R24.2 -89.15,99.73 -89.15,100.58 | -89.15,100.58 C12.2 | -82.55,74.42 -83.82,74.42 -86.8,77.4 R31.1 -88.83,77.4 -89.15,77.72 | -82.55,74.42 U9.2 | v-80.26,74.42 -82.55,74.42 | v-77.98,83.31 -76.22,83.31 C15.2 | R30.2 -89.15,76.87 -89.15,77.72 | -89.15,77.72 C16.2 | -82.55,52.83 -83.82,52.83 -86.8,55.81 R37.1 -88.83,55.81 -89.15,56.13 | -82.55,52.83 U11.2 | v-80.26,52.83 -82.55,52.83 | v-77.98,61.72 -76.22,61.72 C19.2 | R36.2 -89.15,55.28 -89.15,56.13 | -89.15,56.13 C20.2 | -82.55,32.51 -83.82,32.51 -86.8,35.49 R43.1 -88.83,35.49 -89.15,35.81 | -82.55,32.51 U13.2 | v-80.26,32.51 -82.55,32.51 | v-77.98,41.4 -76.22,41.4 C23.2 | R42.2 -89.15,34.96 -89.15,35.81 | -89.15,35.81 C24.2
  Bottom 0.635: v-77.98,106.17 -77.98,107.36 JMP2.3 -79.42,107.7 -80.26,106.86 v-80.26,97.28 | v-77.98,83.31 -77.98,84.5 JMP4.3 -79.42,84.84 -80.26,84 v-80.26,74.42 | v-77.98,61.72 -77.98,62.91 JMP6.3 -79.42,63.25 -80.26,62.41 v-80.26,52.83 | v-77.98,41.4 -77.98,42.59 JMP8.3 -79.42,42.93 -80.26,42.09 v-80.26,32.51
GPS_RX  (1 unrouted)
GPS_TX  (1 unrouted)
HEAD_BTN  (1 unrouted)
HEAD_CTRL  (1 unrouted)
LEFT_BTN  (1 unrouted)
LEFT_CTRL  (1 unrouted)
MISO  (1 unrouted)
MOSI  (1 unrouted)
N$1  (1 unrouted)
N$2  (1 unrouted)
N$3  (2 unrouted)
N$4  (2 unrouted)
N$5  (2 unrouted)
N$6  (2 unrouted)
N$7  (2 unrouted)
N$8  (2 unrouted)
N$9  (2 unrouted)
N$10  (6 unrouted)
N$11  (1 unrouted)
N$12  (1 unrouted)
N$13  (2 unrouted)
N$14  (2 unrouted)
N$15  (1 unrouted)
N$16  (1 unrouted)
N$17  (2 unrouted)
N$18  (2 unrouted)
N$19  (1 unrouted)
N$20  (1 unrouted)
N$21  (1 unrouted)
N$22  (1 unrouted)
N$23  (1 unrouted)
N$24  (1 unrouted)
N$25  (7 unrouted)
N$31
  Top 0.635: D12.A -86.68,108.46 L3.2 -84.9,100.12 U7.1
N$32
  Bottom 0.305: JMP2.2 -75.95,103.25 R26.E
N$33
  Top 0.305: U7.3 -80.52,98.72 -78.66,100.58 R26.S
N$34  (via drill 0.35)
  Top 0.305: C12.1 -87.38,104.88 -87.12,104.62 v-87.12,103.89 | v-81.28,102.62 -82.55,101.35 U7.5
  Top 0.635: JP1.1 -91.97,104.88 -91.44,104.88 | -91.44,104.88 C12.1 | D12.C -91.69,105.12 -91.44,104.88
  Bottom 0.305: v-81.28,102.62 -86.36,102.62 -87.12,103.38 v-87.12,103.89
N$35
  Top 0.305: R25.2 -86.17,98.36 -84.33,96.52 -79.5,96.52 -79.5,97.79 -79.25,98.04 R26.A
  Top 0.635: JP1.2 -91.78,101.18 R24.1 -91.78,98.55 -90.77,97.54 -87.12,97.54 R25.2
N$41
  Top 0.635: D14.A -86.68,85.6 L5.2 -84.9,77.26 U9.1
N$42
  Bottom 0.305: JMP4.2 -75.95,80.39 R32.E
N$43
  Top 0.305: U9.3 -80.52,75.86 -78.66,77.72 R32.S
N$44  (via drill 0.35)
  Top 0.305: C16.1 -87.38,82.02 -87.12,81.76 v-87.12,81.03 | v-81.28,79.76 -82.55,78.49 U9.5
  Top 0.635: JP2.1 -91.97,82.02 -91.44,82.02 | -91.44,82.02 C16.1 | D14.C -91.69,82.27 -91.44,82.02
  Bottom 0.305: v-81.28,79.76 -86.36,79.76 -87.12,80.52 v-87.12,81.03
N$45
  Top 0.305: R31.2 -86.17,75.5 -84.33,73.66 -79.5,73.66 -79.5,74.93 -79.25,75.18 R32.A
  Top 0.635: JP2.2 -91.78,78.32 R30.1 -91.78,75.69 -90.77,74.68 -87.12,74.68 R31.2
N$51
  Top 0.635: D16.A -86.68,64.01 L7.2 -84.9,55.67 U11.1
N$52
  Bottom 0.305: JMP6.2 -75.95,58.8 R38.E
N$53
  Top 0.305: U11.3 -80.52,54.27 -78.66,56.13 R38.S
N$54  (via drill 0.35)
  Top 0.305: C20.1 -87.38,60.43 -87.12,60.17 v-87.12,59.44 | v-81.28,58.17 -82.55,56.9 U11.5
  Top 0.635: JP3.1 -91.97,60.43 -91.44,60.43 | -91.44,60.43 C20.1 | D16.C -91.69,60.67 -91.44,60.43
  Bottom 0.305: v-81.28,58.17 -86.36,58.17 -87.12,58.93 v-87.12,59.44
N$55
  Top 0.305: R37.2 -86.17,53.91 -84.33,52.07 -79.5,52.07 -79.5,53.34 -79.25,53.59 R38.A
  Top 0.635: JP3.2 -91.78,56.73 R36.1 -91.78,54.1 -90.77,53.09 -87.12,53.09 R37.2
N$61
  Top 0.635: D18.A -86.68,43.69 L9.2 -84.9,35.35 U13.1
N$62
  Bottom 0.305: JMP8.2 -75.95,38.48 R44.E
N$63
  Top 0.305: U13.3 -80.52,33.95 -78.66,35.81 R44.S
N$64  (via drill 0.35)
  Top 0.305: C24.1 -87.38,40.11 -87.12,39.85 v-87.12,39.12 | v-81.28,37.85 -82.55,36.58 U13.5
  Top 0.635: JP4.1 -91.97,40.11 -91.44,40.11 | -91.44,40.11 C24.1 | D18.C -91.69,40.35 -91.44,40.11
  Bottom 0.305: v-81.28,37.85 -86.36,37.85 -87.12,38.61 v-87.12,39.12
N$65
  Top 0.305: R43.2 -86.17,33.59 -84.33,31.75 -79.5,31.75 -79.5,33.02 -79.25,33.27 R44.A
  Top 0.635: JP4.2 -91.78,36.41 R42.1 -91.78,33.78 -90.77,32.77 -87.12,32.77 R43.2
RF_INT  (1 unrouted)
RIGHT_BTN  (1 unrouted)
RIGHT_CTRL  (1 unrouted)
TAIL_BTN  (1 unrouted)
TAIL_CTRL  (1 unrouted)
V+  (via drill 0.35)  (17 unrouted)
  Top 0.305: U13.6 -83.5,40.2 -82.55,41.15 -80.96,41.15 L9.1 | U11.6 -83.5,60.52 -82.55,61.47 -80.96,61.47 L7.1 -80.2,62.52 | U9.6 -83.5,82.11 -82.55,83.06 -80.96,83.06 L5.1 | U7.6 -83.5,104.97 -82.55,105.92 -80.96,105.92 L3.1
  Top 0.635: L9.1 -80.2,42.2 -77.98,44.43 C23.1 -74.17,44.43 v-74.17,41.4 | -80.2,62.52 -77.98,64.75 C19.1 -74.17,64.75 v-74.17,61.72 | L5.1 -80.2,84.11 -77.98,86.34 C15.1 -74.17,86.34 v-74.17,83.31 | L3.1 -80.2,106.97 -77.98,109.2 C11.1 -74.17,109.2 v-74.17,106.17
  Bottom 0.635: v-74.17,41.4 -74.17,42.85 | v-74.17,61.72 -74.17,63.17 | v-74.17,83.31 -74.17,84.76 | v-74.17,106.17 -74.17,107.62
VCC  (6 unrouted)